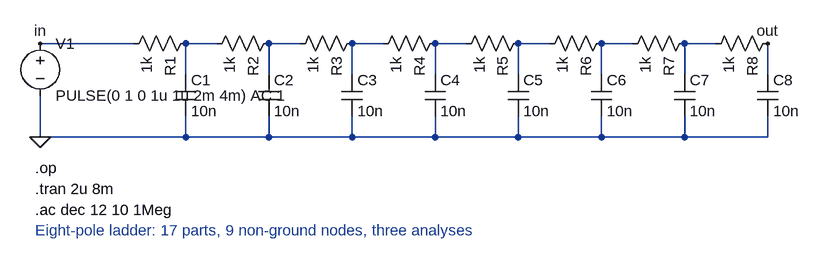
[diagram p0: schematic 11_stress_rc_ladder.asc]
11_stress_rc_ladder.asc, the LTspice schematic file:
Version 4
SHEET 1 1560 680
WIRE 80 96 224 96
WIRE 304 96 352 96
WIRE 432 96 480 96
WIRE 560 96 608 96
WIRE 688 96 736 96
WIRE 816 96 864 96
WIRE 944 96 992 96
WIRE 1072 96 1120 96
WIRE 1200 96 1200 144
WIRE 304 96 304 144
WIRE 432 96 432 144
WIRE 560 96 560 144
WIRE 688 96 688 144
WIRE 816 96 816 144
WIRE 944 96 944 144
WIRE 1072 96 1072 144
WIRE 304 208 304 240
WIRE 432 208 432 240
WIRE 560 208 560 240
WIRE 688 208 688 240
WIRE 816 208 816 240
WIRE 944 208 944 240
WIRE 1072 208 1072 240
WIRE 1200 208 1200 240
WIRE 80 176 80 240
WIRE 80 240 1200 240
FLAG 80 240 0
FLAG 80 96 in
FLAG 1200 96 out
SYMBOL voltage 80 80 R0
SYMATTR InstName V1
SYMATTR Value PULSE(0 1 0 1u 1u 2m 4m) AC 1
SYMBOL res 320 80 R90
SYMATTR InstName R1
SYMATTR Value 1k
SYMBOL res 448 80 R90
SYMATTR InstName R2
SYMATTR Value 1k
SYMBOL res 576 80 R90
SYMATTR InstName R3
SYMATTR Value 1k
SYMBOL res 704 80 R90
SYMATTR InstName R4
SYMATTR Value 1k
SYMBOL res 832 80 R90
SYMATTR InstName R5
SYMATTR Value 1k
SYMBOL res 960 80 R90
SYMATTR InstName R6
SYMATTR Value 1k
SYMBOL res 1088 80 R90
SYMATTR InstName R7
SYMATTR Value 1k
SYMBOL res 1216 80 R90
SYMATTR InstName R8
SYMATTR Value 1k
SYMBOL cap 288 144 R0
SYMATTR InstName C1
SYMATTR Value 10n
SYMBOL cap 416 144 R0
SYMATTR InstName C2
SYMATTR Value 10n
SYMBOL cap 544 144 R0
SYMATTR InstName C3
SYMATTR Value 10n
SYMBOL cap 672 144 R0
SYMATTR InstName C4
SYMATTR Value 10n
SYMBOL cap 800 144 R0
SYMATTR InstName C5
SYMATTR Value 10n
SYMBOL cap 928 144 R0
SYMATTR InstName C6
SYMATTR Value 10n
SYMBOL cap 1056 144 R0
SYMATTR InstName C7
SYMATTR Value 10n
SYMBOL cap 1184 144 R0
SYMATTR InstName C8
SYMATTR Value 10n
TEXT 72 288 Left 2 !.op
TEXT 72 320 Left 2 !.tran 2u 8m
TEXT 72 352 Left 2 !.ac dec 12 10 1Meg
TEXT 72 384 Left 2 ;Eight-pole ladder: 17 parts, 9 non-ground nodes, three analyses

The netlist it stands for:
* 11_stress_rc_ladder.asc
V1 in 0 PULSE(0 1 0 1u 1u 2m 4m) AC 1
R1 N001 in 1k
R2 N002 N001 1k
R3 N003 N002 1k
R4 N004 N003 1k
R5 N005 N004 1k
R6 N006 N005 1k
R7 N007 N006 1k
R8 out N007 1k
C1 N001 0 10n
C2 N002 0 10n
C3 N003 0 10n
C4 N004 0 10n
C5 N005 0 10n
C6 N006 0 10n
C7 N007 0 10n
C8 out 0 10n
.op
.tran 2u 8m
.ac dec 12 10 1Meg
* Eight-pole ladder: 17 parts, 9 non-ground nodes, three analyses
.backanno
.end